# EAGLE design Lynx_Shield (EAGLE 9.6.2)
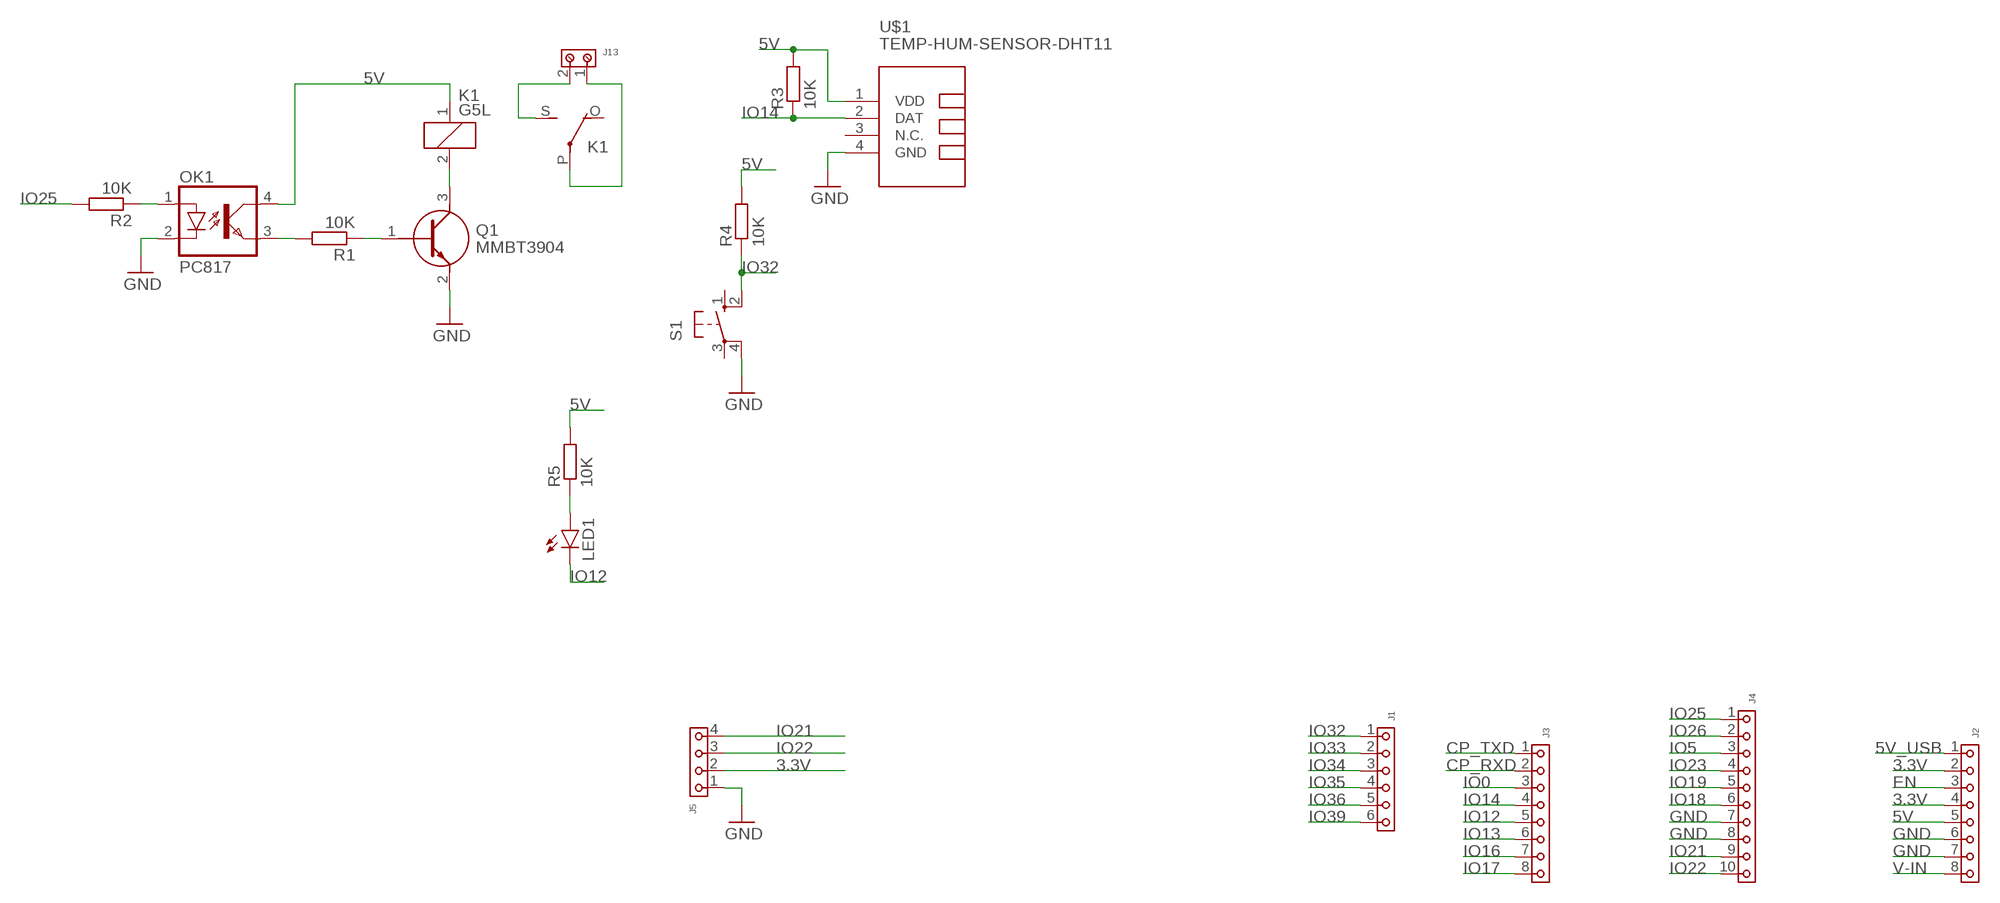
[diagram p0: schematic, sheet 1]

## Parts
J1  6130XX11821_61300611821  [61300611821]
J2  6130XX11821_61300811821  [61300811821]
J3  6130XX11821_61300811821  [61300811821]
J4  6130XX11821_61301011821  [61301011821]
J5  6130XX11821_61300411821  [61300411821]
J13  691134710002  [691134710002]
K1  G5L  [G5LE]
LED1  LED5MM  [LED5MM]
OK1  PC817  [DIL04]
Q1  MMBT3904  [SOT95P240X120-3N]
R1  10K  R-EU_R0603  [R0603]
R2  10K  R-EU_R0603  [R0603]
R3  10K  R-EU_R0603  [R0603]
R4  10K  R-EU_R0603  [R0603]
R5  10K  R-EU_R0603  [R0603]
S1  10-XX  [B3F-10XX]
U$1  TEMP-HUM-SENSOR-DHT11  [TEMP-HUM-SENSOR-DHT11]

## Nets
3.3V: J2.2 J2.4 J5.2
5V: J2.5 K1.1 OK1.4(COL) R3.2 R4.2 R5.2 U$1.1(VDD)
5V_USB: J2.1
CP_RXD: J3.2
CP_TXD: J3.1
EN: J2.3
GND: J2.6 J2.7 J4.7 J4.8 J5.1 OK1.2(C) Q1.2(E) S1.4(P1) U$1.4(GND)
IO0: J3.3
IO5: J4.3
IO12: J3.5 LED1.K(C)
IO13: J3.6
IO14: J3.4 R3.1 U$1.2(DAT)
IO16: J3.7
IO17: J3.8
IO18: J4.6
IO19: J4.5
IO21: J4.9 J5.4
IO22: J4.10 J5.3
IO23: J4.4
IO25: J4.1 R2.2
IO26: J4.2
IO32: J1.1 R4.1 S1.2(S1)
IO33: J1.2
IO34: J1.3
IO35: J1.4
IO36: J1.5
IO39: J1.6
N$1: OK1.3(EMIT) R1.2
N$2: J13.2 K1.S(2:S)
N$4: J13.1 K1.P(2:P)
N$5: OK1.1(A) R2.1
N$6: K1.2 Q1.3(C)
N$8: Q1.1(B) R1.1
N$10: LED1.A R5.1
V-IN: J2.8
Unconnected: K1.O(2:O) S1.1(S) S1.3(P) U$1.3(N.C.)

## Library data of the parts
J1 = Wurth_Connectors_WR-PHD:6130XX11821_61300611821: WR-PHD 2.54 mm Socket Header ARTICLE PROPERTIES: Pins:1;​ 2;​ 3;​ 4;​ 5;​ 6;​ 7;​ 8;​ 9;​ 10;​ 12;​ 13;​ 14;​ 15;​ 16;​ 18;​ 20;​ 22;​ 24;​ 25;​ 32;​ 36;​ 40 KIND PROPERTIES: Pitch：2.54 mm Quality Class:3 as per CECC 75 301-802 Rows：Single Gender：Socket Header;​ Female Type：Straight MATERIAL PROPERTIES: Insulator Material :PBT Insulator Flammability Rating:UL94 V-0 Contact Material:Copper Alloy Contact Plating:Gold Contact Type:Stamped GENERAL INFORMATION Operating Temperature:-40 up to +125 °C Compliance:Lead free / RoHS ELECTRICAL PROPERTIES: Rated Current:3 A IR 1:3 A Withstanding Voltage:500 V (AC) Contact Resistance:20 mΩ RISO:1000 MΩ CERTIFICATION UL Approval:E323964 PACKAGING PROPERTIES Packaging:Tray <https://katalog.we-online.com/media/images/v2/o33218v209%20Family_WR-PHD_613xxx11821.jpg> Details see: https://katalog.we-online.com/en/em/PHD_2_54_SOCKET_HEADER_6130XX11821 Updated by Yingchun,Shan 2019-10-21 2019 (C) Würth Elektronik; DATASHEET-URL: https://katalog.we-online.com/em/datasheet/61300611821.pdf; GENDER: Socket Header; IR: 3A; MATES: WR-PHD 2.54mm SMT Pin Header/THT Angled Pin Header/THT Pin Header; PACKAGING: Tray; PART-NUMBER: 61300611821; PINS: 6; ROWS: Single; TYPE: Straight
J2 J3 = Wurth_Connectors_WR-PHD:6130XX11821_61300811821: WR-PHD 2.54 mm Socket Header ARTICLE PROPERTIES: Pins:1;​ 2;​ 3;​ 4;​ 5;​ 6;​ 7;​ 8;​ 9;​ 10;​ 12;​ 13;​ 14;​ 15;​ 16;​ 18;​ 20;​ 22;​ 24;​ 25;​ 32;​ 36;​ 40 KIND PROPERTIES: Pitch：2.54 mm Quality Class:3 as per CECC 75 301-802 Rows：Single Gender：Socket Header;​ Female Type：Straight MATERIAL PROPERTIES: Insulator Material :PBT Insulator Flammability Rating:UL94 V-0 Contact Material:Copper Alloy Contact Plating:Gold Contact Type:Stamped GENERAL INFORMATION Operating Temperature:-40 up to +125 °C Compliance:Lead free / RoHS ELECTRICAL PROPERTIES: Rated Current:3 A IR 1:3 A Withstanding Voltage:500 V (AC) Contact Resistance:20 mΩ RISO:1000 MΩ CERTIFICATION UL Approval:E323964 PACKAGING PROPERTIES Packaging:Tray <https://katalog.we-online.com/media/images/v2/o33218v209%20Family_WR-PHD_613xxx11821.jpg> Details see: https://katalog.we-online.com/en/em/PHD_2_54_SOCKET_HEADER_6130XX11821 Updated by Yingchun,Shan 2019-10-21 2019 (C) Würth Elektronik; DATASHEET-URL: https://katalog.we-online.com/em/datasheet/61300811821.pdf; GENDER: Socket Header; IR: 3A; MATES: WR-PHD 2.54mm SMT Pin Header/THT Angled Pin Header/THT Pin Header; PACKAGING: Tray; PART-NUMBER: 61300811821; PINS: 8; ROWS: Single; TYPE: Straight
J4 = Wurth_Connectors_WR-PHD:6130XX11821_61301011821: WR-PHD 2.54 mm Socket Header ARTICLE PROPERTIES: Pins:1;​ 2;​ 3;​ 4;​ 5;​ 6;​ 7;​ 8;​ 9;​ 10;​ 12;​ 13;​ 14;​ 15;​ 16;​ 18;​ 20;​ 22;​ 24;​ 25;​ 32;​ 36;​ 40 KIND PROPERTIES: Pitch：2.54 mm Quality Class:3 as per CECC 75 301-802 Rows：Single Gender：Socket Header;​ Female Type：Straight MATERIAL PROPERTIES: Insulator Material :PBT Insulator Flammability Rating:UL94 V-0 Contact Material:Copper Alloy Contact Plating:Gold Contact Type:Stamped GENERAL INFORMATION Operating Temperature:-40 up to +125 °C Compliance:Lead free / RoHS ELECTRICAL PROPERTIES: Rated Current:3 A IR 1:3 A Withstanding Voltage:500 V (AC) Contact Resistance:20 mΩ RISO:1000 MΩ CERTIFICATION UL Approval:E323964 PACKAGING PROPERTIES Packaging:Tray <https://katalog.we-online.com/media/images/v2/o33218v209%20Family_WR-PHD_613xxx11821.jpg> Details see: https://katalog.we-online.com/en/em/PHD_2_54_SOCKET_HEADER_6130XX11821 Updated by Yingchun,Shan 2019-10-21 2019 (C) Würth Elektronik; DATASHEET-URL: https://katalog.we-online.com/em/datasheet/61301011821.pdf; GENDER: Socket Header; IR: 3A; MATES: WR-PHD 2.54mm SMT Pin Header/THT Angled Pin Header/THT Pin Header; PACKAGING: Tray; PART-NUMBER: 61301011821; PINS: 10; ROWS: Single; TYPE: Straight
J5 = Wurth_Connectors_WR-PHD:6130XX11821_61300411821: WR-PHD 2.54 mm Socket Header ARTICLE PROPERTIES: Pins:1;​ 2;​ 3;​ 4;​ 5;​ 6;​ 7;​ 8;​ 9;​ 10;​ 12;​ 13;​ 14;​ 15;​ 16;​ 18;​ 20;​ 22;​ 24;​ 25;​ 32;​ 36;​ 40 KIND PROPERTIES: Pitch：2.54 mm Quality Class:3 as per CECC 75 301-802 Rows：Single Gender：Socket Header;​ Female Type：Straight MATERIAL PROPERTIES: Insulator Material :PBT Insulator Flammability Rating:UL94 V-0 Contact Material:Copper Alloy Contact Plating:Gold Contact Type:Stamped GENERAL INFORMATION Operating Temperature:-40 up to +125 °C Compliance:Lead free / RoHS ELECTRICAL PROPERTIES: Rated Current:3 A IR 1:3 A Withstanding Voltage:500 V (AC) Contact Resistance:20 mΩ RISO:1000 MΩ CERTIFICATION UL Approval:E323964 PACKAGING PROPERTIES Packaging:Tray <https://katalog.we-online.com/media/images/v2/o33218v209%20Family_WR-PHD_613xxx11821.jpg> Details see: https://katalog.we-online.com/en/em/PHD_2_54_SOCKET_HEADER_6130XX11821 Updated by Yingchun,Shan 2019-10-21 2019 (C) Würth Elektronik; DATASHEET-URL: https://katalog.we-online.com/em/datasheet/61300411821.pdf; GENDER: Socket Header; IR: 3A; MATES: WR-PHD 2.54mm SMT Pin Header/THT Angled Pin Header/THT Pin Header; PACKAGING: Tray; PART-NUMBER: 61300411821; PINS: 4; ROWS: Single; TYPE: Straight
J13 = Wurth_Connectors_WR-TBL Wire Protector:691134710002: WR-TBL Serie 1347- 5.00 mm Horizontal Cable Entry w. Pressure Clamp KIND PROPERTIES Pitch 5 mm MATERIAL PROPERTIES Insulator Material PC Insulator Flammability Rating UL94 V-0 Insulator Color Grey Contact Material Copper Alloy Contact Plating Nickel over Tin Contact Type Stamped Terminal Screw Material Steel Terminal Screw Plating Zinc Wire Guard Material Copper Alloy GENERAL INFORMATION Operating Temperature -30 up to +120 °C Compliance Lead free / RoHS ELECTRICAL PROPERTIES IR UL 16 A IR VDE 24 A Working Voltage [UL] 300 V (AC) Working Voltage [VDE] 450 V (AC) Withstanding Voltage [UL] 1600 V (AC) Withstanding Voltage [cULus] 2000 V (AC) Withstanding Voltage [VDE] 2500 V (AC) Contact Resistance 20 mΩ Contact Resistance [UL] 20 mΩ Contact Resistance [VDE] 20 mΩ MECHANICAL PROPERTIES Wire Strip Length 7 (mm) Screw M3 Solid Wire Section (AWG) 30 to 14 (AWG) Solid Wire Section (Metric) 0.05 to 2.08 (mm²) Stranded Wire Section (AWG) 30 to 14 (AWG) Stranded Wire Section (Metric) 0.05 to 2.08 (mm²) CERTIFICATION UL Approval E150931 CAT N: CMM (1) VDE Approval 40021362 VDE Approval 40021375 TYPE: CMM PACKAGING PROPERTIES Packaging Box <https://katalog.we-online.com/media/images/v2/o32799v209%20Family_WR-TBL1_Series1347.jpg> Details see: https://katalog.we-online.com/en/em/TBL_5_00_1347_HORIZONTAL_ENTRY_W_PRESSURE_CLAMP_69113471000x Updated by Ella Wu 2019-11-08 2019(C) Wurth Elektronik; DATASHEET-URL: https://www.we-online.com/catalog/datasheet/691134710002.pdf; IR-UL: 16A; IR-VDE: 24A; MOUNT: THT; PART-NUMBER: 691134710002; PINS: 2; PITCH: 5mm; TYPE: Horizontal; WIRE: 30 to 14 (AWG) 0.05 to 2.08 (mm²); WORKING-VOLTAGE-UL: 300V(AC); WORKING-VOLTAGE-VDE: 450V(AC)
K1 = relay:G5L: RELAY 1 x switch, 10 A/120 V AC, 8 A/30 V ADC, Omron; OC_FARNELL: unknown; OC_NEWARK: unknown
LED1 = led:LED: LED OSRAM: - CHIPLED LG R971, LG N971, LY N971, LG Q971, LY Q971, LO R971, LY R971 LH N974, LH R974 LS Q976, LO Q976, LY Q976 LO Q996 - Hyper CHIPLED LW Q18S LB Q993, LB Q99A, LB R99A - SideLED LS A670, LO A670, LY A670, LG A670, LP A670 LB A673, LV A673, LT A673, LW A673 LH A674 LY A675 LS A676, LA A676, LO A676, LY A676, LW A676 LS A679, LY A679, LG A679 - Hyper Micro SIDELED® LS Y876, LA Y876, LO Y876, LY Y876 LT Y87S - SmartLED LW L88C, LW L88S LB L89C, LB L89S, LG L890 LS L89K, LO L89K, LY L89K LS L896, LA L896, LO L896, LY L896 - TOPLED LS T670, LO T670, LY T670, LG T670, LP T670 LSG T670, LSP T670, LSY T670, LOP T670, LYG T670 LG T671, LOG T671, LSG T671 LB T673, LV T673, LT T673, LW T673 LH T674 LS T676, LA T676, LO T676, LY T676, LB T676, LH T676, LSB T676, LW T676 LB T67C, LV T67C, LT T67C, LS T67K, LO T67K, LY T67K, LW E67C LS E67B, LA E67B, LO E67B, LY E67B, LB E67C, LV E67C, LT E67C LW T67C LS T679, LY T679, LG T679 LS T770, LO T770, LY T770, LG T770, LP T770 LB T773, LV T773, LT T773, LW T773 LH T774 LS E675, LA E675, LY E675, LS T675 LS T776, LA T776, LO T776, LY T776, LB T776 LHGB T686 LT T68C, LB T68C - Hyper Mini TOPLED® LB M676 - Mini TOPLED Santana® LG M470 LS M47K, LO M47K, LY M47K Source: http://www.osram.convergy.de LUXEON: - LUMILED® LXK2-PW12-R00, LXK2-PW12-S00, LXK2-PW14-U00, LXK2-PW14-V00 LXK2-PM12-R00, LXK2-PM12-S00, LXK2-PM14-U00 LXK2-PE12-Q00, LXK2-PE12-R00, LXK2-PE12-S00, LXK2-PE14-T00, LXK2-PE14-U00 LXK2-PB12-K00, LXK2-PB12-L00, LXK2-PB12-M00, LXK2-PB14-N00, LXK2-PB14-P00, LXK2-PB14-Q00 LXK2-PR12-L00, LXK2-PR12-M00, LXK2-PR14-Q00, LXK2-PR14-R00 LXK2-PD12-Q00, LXK2-PD12-R00, LXK2-PD12-S00 LXK2-PH12-R00, LXK2-PH12-S00 LXK2-PL12-P00, LXK2-PL12-Q00, LXK2-PL12-R00 Source: www.luxeon.com KINGBRIGHT: KA-3528ASYC Source: www.kingbright.com
OK1 = optocoupler:PC817: SHARP OPTO COUPLER; MPN: PC817X4J000F; OC_FARNELL: 9707727; OC_NEWARK: 97K7059
Q1 = MMBT3904:MMBT3904: Transistor GP BJT NPN 40V 0.2A SOT23 Fairchild MMBT3904 NPN Bipolar Transistor, 0.2 A, 40 V, 3-Pin SOT-23 Source: Datasheet <https://media.digikey.com/pdf/Data Sheets/ON Semiconductor PDFs/2N3904,MMBT3904,PZT3904.pdf>; ARROW_PART_NUMBER: MMBT3904; ARROW_PRICE-STOCK: https://www.arrow.com/en/products/mmbt3904/on-semiconductor; DESCRIPTION: Transistor GP BJT NPN 40V 0.2A SOT23 Fairchild MMBT3904 NPN Bipolar Transistor, 0.2 A, 40 V, 3-Pin SOT-23; HEIGHT: 1.2mm; MANUFACTURER_NAME: ON Semiconductor; MANUFACTURER_PART_NUMBER: MMBT3904; MOUSER_PART_NUMBER: 512-MMBT3904; MOUSER_PRICE-STOCK: https://www.mouser.co.uk/ProductDetail/ON-Semiconductor-Fairchild/MMBT3904?qs=UMEuL5FsraCg3xKjS4uBJQ%3D%3D
R1-R5 = rcl:R-EU_: RESISTOR, European symbol; SPICEPREFIX: R
S1 = switch-omron:10-XX: OMRON SWITCH; MPN: B3F-1000; OC_FARNELL: 176432; OC_NEWARK: 36M3542
U$1 = diy-modules:TEMP-HUM-SENSOR-DHT11: DHT11 - digital humidity & temperature sensor DHT11 datasheet available here: https://akizukidenshi.com/download/ds/aosong/DHT11.pdf Click here to find device on ebay.com <http://www.ebay.com/sch/dht11+digital+sensor>

## Board
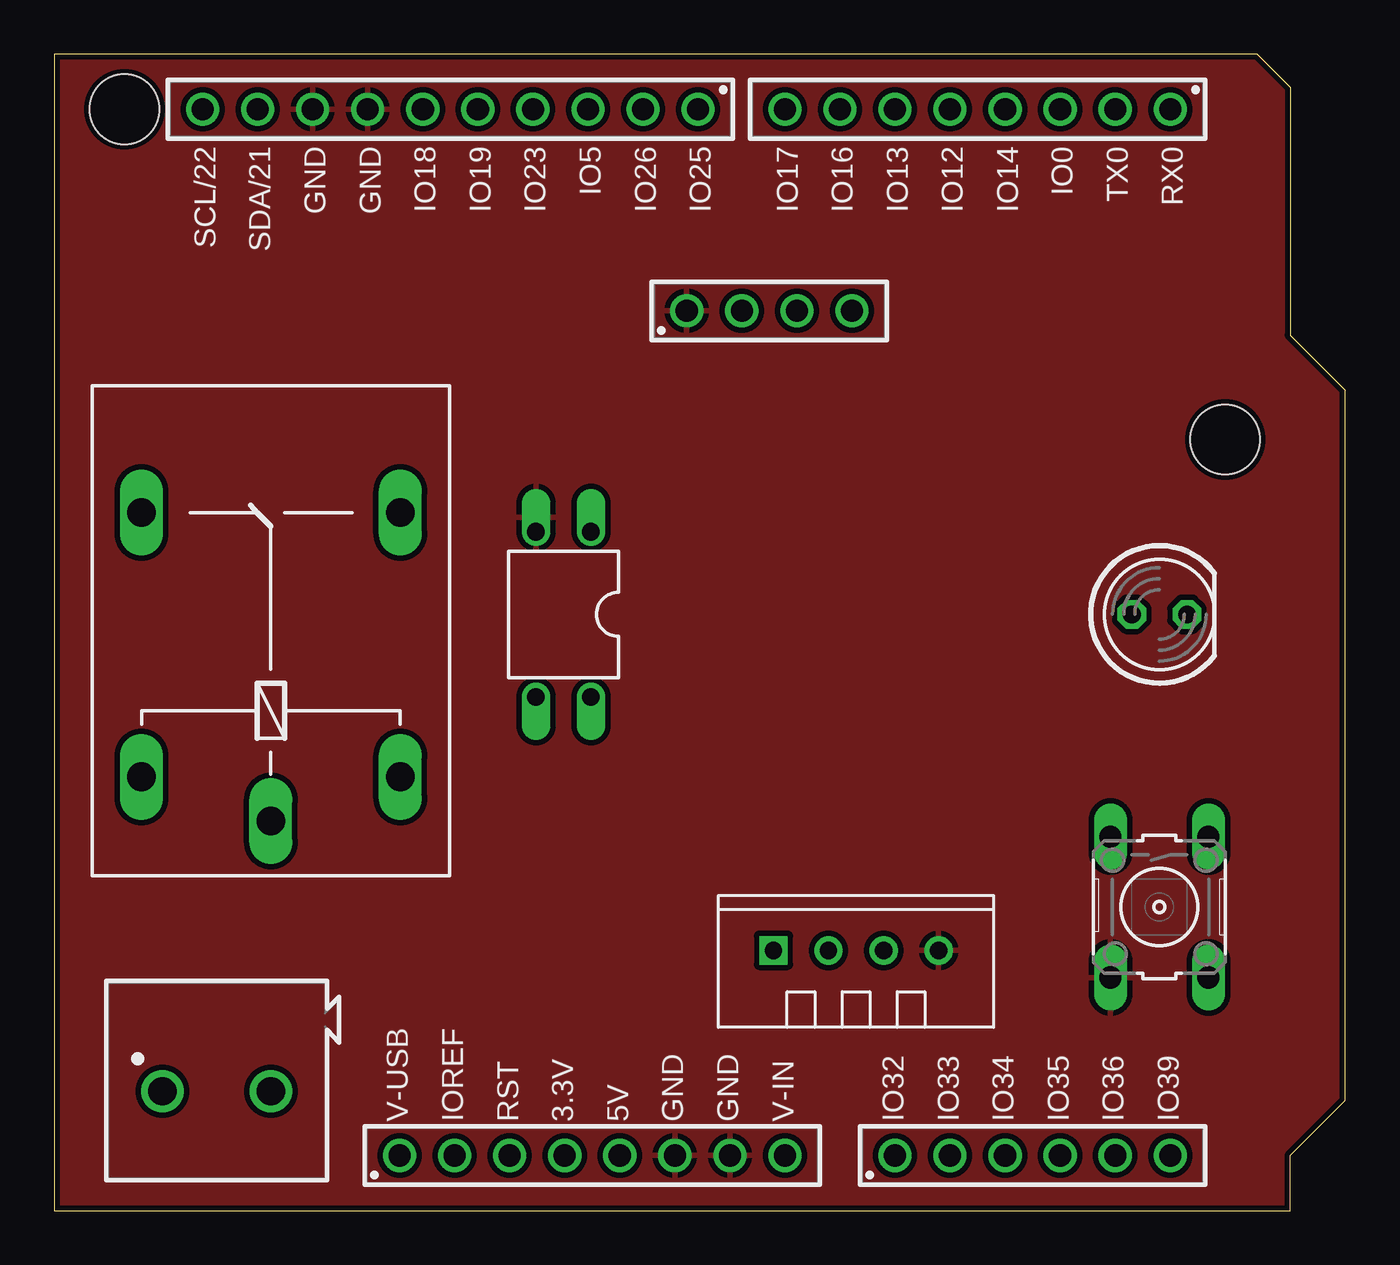
[diagram p1: board, top side]
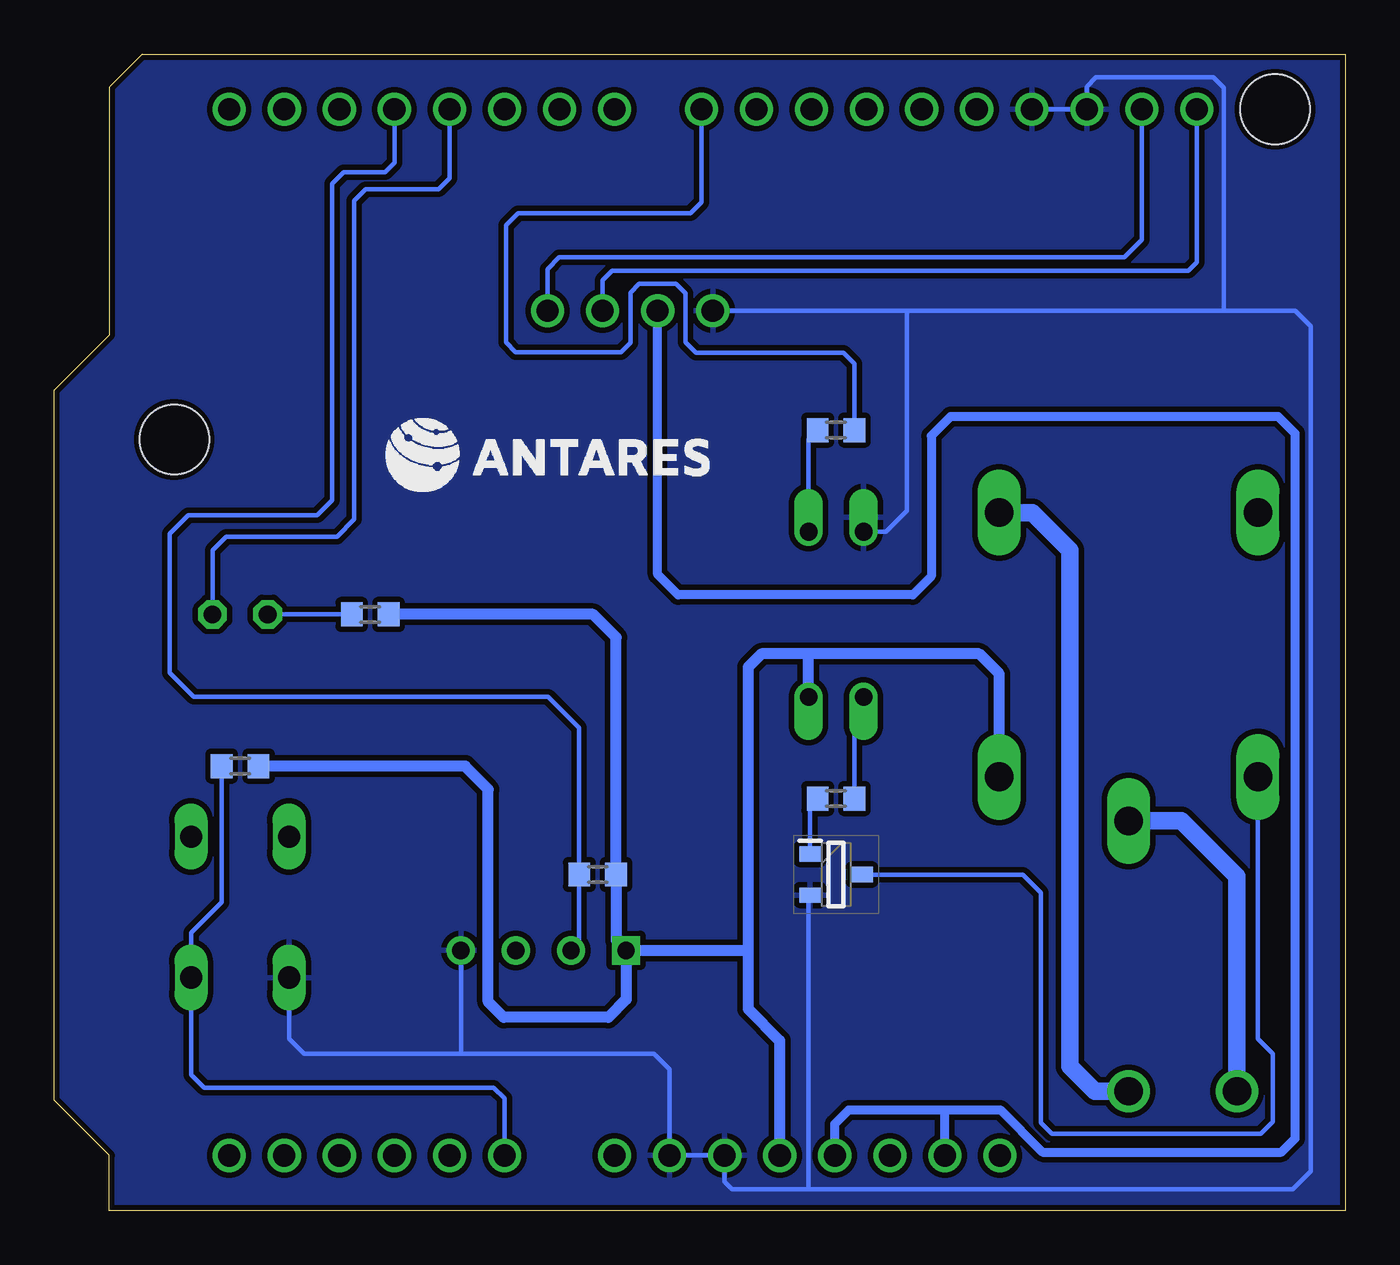
[diagram p2: board, bottom side, seen from below]

Size 59.58 x 53.34 mm. Coordinates in mm from the lower left corner, seen from the top.
Outline: 0,0 57.04,0 57.04,2.54 59.58,5.08 59.58,37.84 57.04,40.38 57.04,51.82 55.52,53.34 0,53.34 0,0
Copper layers (1*16): Top 0.035mm / dielectric 0.2mm / Bottom 0.035mm
Design rules "default *": minimum track width 5mil, minimum drill 0.25mm, track to track 5mil, track to pad 6mil, pad to pad 6mil, via to via 6mil, smd to smd 6mil, copper to edge 10mil, drill to drill 6mil, minimum pad ring 10mil, minimum via ring 8mil, stop-mask expansion 4mil, vias tented up to drill 25mil, thermal gap 10mil
Holes 3.2 mm at 54.04,35.56 3.24,50.8
vRestrict: 3 lines

### Footprints (pad centres in the part's own frame; a part is rotated, then mirrored left to right if it is on the bottom)
61300611821 = drill 1.02: 1 -6.35,0; 2 -3.81,0; 3 -1.27,0; 4 1.27,0; 5 3.81,0; 6 6.35,0
61300811821 = drill 1.02: 1 -8.89,0; 2 -6.35,0; 3 -3.81,0; 4 -1.27,0; 5 1.27,0; 6 3.81,0; 7 6.35,0; 8 8.89,0
61301011821 = drill 1.02: 1 -11.43,0; 2 -8.89,0; 3 -6.35,0; 4 -3.81,0; 5 -1.27,0; 6 1.27,0; 7 3.81,0; 8 6.35,0; 9 8.89,0; 10 11.43,0
61300411821 = drill 1.02: 1 -3.81,0; 2 -1.27,0; 3 1.27,0; 4 3.81,0
691134710002 = drill 1.3: 1 -2.5,0; 2 2.5,0
G5LE = drill 1.321 long: 1 -7.493,-5.969; 2 -7.493,5.969; O 4.699,5.969; P -9.525,0; S 4.699,-5.969
LED5MM = drill 0.813 octagon: A -1.27,0; K 1.27,0
DIL04 = drill 0.813 offset: 1 -1.27,-3.81; 2 1.27,-3.81; 3 1.27,3.81; 4 -1.27,3.81
SOT95P240X120-3N = smd 1 x 0.7: 1 -1.2,0.95; 2 -1.2,-0.95; 3 1.2,0
R0603 = smd 1 x 1.1: 1 -0.85,0; 2 0.85,0
B3F-10XX = drill 1.016 long: 1 -3.251,2.261; 2 3.251,2.261; 3 -3.251,-2.261; 4 3.251,-2.261
TEMP-HUM-SENSOR-DHT11 = drill 0.8 square: 1 -3.81,0 | drill 0.8: 2 -1.27,0; 3 1.27,0; 4 3.81,0

### Placement (x,y rotation side)
J1  45.15,2.54 0 top
J2  24.83,2.54 0 top
J3  42.61,50.8 180 top
J4  18.28,50.8 180 top
J5  33,41.5 0 top
J13  7.5,5.5 0 top
K1  10,27.5 90 top
LED1  51,27.5 0 top
OK1  23.5,27.5 180 top
Q1  23.5,15.5 0 bottom
R1  23.5,19 0 bottom
R2  23.5,36 0 bottom
R3  34.5,15.5 0 bottom
R4  51,20.5 0 bottom
R5  45,27.5 0 bottom
S1  51,14 270 top
U$1  37,12 0 top

### Tracks (layer width: path | path; a pad name or v marks a point on that pad's centre or on a via)
3.3V
  Bottom 0.406: J2.4 23.56,4 22.91,4.65 18.52,4.65 | 18.52,4.65 15.93,4.65 13.97,2.69 2.95,2.69 2.31,3.33 2.31,35.84 3.1,36.63 18.21,36.63 19.1,35.74 19.1,29.26 19.96,28.4 30.79,28.4 31.73,29.34 J5.2 | J2.2 18.48,4.61 18.52,4.65
5V
  Bottom 0.508: K1.1 15.97,24.76 16.89,25.68 24.77,25.68 | 24.77,25.68 26.95,25.68 27.56,25.07 27.56,11.96 | OK1.4 24.77,25.67 24.77,25.68 | 27.56,11.96 27.56,9.3 26.1,7.84 J2.5 | U$1.1 27.6,12 27.56,11.96 | U$1.1 33.65,12.46 R3.2 33.65,26.44 34.71,27.5 R5.2 | U$1.1 33.19,9.74 34.01,8.91 38.84,8.91 39.55,9.63 39.55,19.43 40.62,20.5 R4.2
GND
  Bottom 0.203: 40.82,7.24 31.9,7.24 31.18,6.52 J2.7 J2.6 28.64,1.33 28.3,0.99 24.77,0.99 | 40.82,7.24 48.06,7.24 48.74,7.92 S1.4 | U$1.4 40.81,7.25 40.82,7.24 | OK1.2 21.19,31.31 20.22,32.28 20.22,41.5 | 20.22,41.5 J5.1 | Q1.2 24.77,14.48 24.77,0.99 | J4.7 J4.8 11.93,51.85 11.51,52.27 6.1,52.27 5.61,51.79 5.61,41.5 | 5.61,41.5 20.22,41.5 | 24.77,0.99 2.41,0.99 1.6,1.8 1.6,40.79 2.31,41.5 5.61,41.5
  pour Bottom (isolate 0.254): 0,0 60,0 60,24 60,54 50,54 0,54
  pour Top (isolate 0.254): 0,0 60,0 60,27 60,54 24,54 0,54
IO12
  Bottom 0.203: LED1.K 52.27,30.46 51.64,31.09 46.53,31.09 45.74,31.88 45.74,46.58 45.21,47.12 41.83,47.12 41.34,47.61 J3.5
IO14
  Bottom 0.203: U$1.2 35.35,12.38 R3.1 35.35,22.27 36.78,23.7 53.14,23.7 54.25,24.82 54.25,31.22 53.39,32.08 47.45,32.08 46.76,32.77 46.76,47.37 46.23,47.9 44.3,47.9 43.88,48.32 J3.4
IO21
  Bottom 0.203: J5.4 36.81,43.43 36.27,43.97 10.2,43.97 9.39,44.78 J4.9
IO22
  Bottom 0.203: J5.3 34.27,42.92 33.83,43.36 7.24,43.36 6.85,43.75 J4.10
IO25
  Bottom 0.203: R2.2 22.65,39.06 23.16,39.57 29.97,39.57 30.45,40.06 30.45,42.32 30.89,42.75 32.59,42.75 32.99,42.34 32.99,40.03 33.43,39.6 38.28,39.6 38.73,40.06 38.73,45.44 38.18,46 30.23,46 29.71,46.52 J4.1
IO32
  Bottom 0.203: R4.1 51.85,14.21 53.26,12.8 S1.2 53.26,6.27 52.65,5.66 39.29,5.66 38.8,5.17 J1.1
N$1
  Bottom 0.203: OK1.3 22.65,23.27 R1.2
N$2
  Bottom 0.813: K1.S 14.44,32.2 12.7,30.45 12.7,6.65 11.55,5.5 J13.2
N$4
  Bottom 0.813: K1.P 7.56,17.98 5,15.41 J13.1
N$5
  Bottom 0.203: R2.1 24.77,35.58 OK1.1
N$6
  Bottom 0.203: K1.2 4.03,7.92 3.35,7.24 3.35,4.09 3.91,3.53 13.54,3.53 14.05,4.04 14.05,14.66 14.89,15.5 Q1.3
N$8
  Bottom 0.203: R1.1 24.7,18.65 Q1.1
N$10
  Bottom 0.203: R5.1 LED1.A

### Text on the board
tPlace: SCL/22 | SDA/21 | GND | GND | IO18 | IO19 | IO23 | IO5 | IO26 | IO25 | IO17 | IO16 | IO13 | IO12 | IO14 | IO0 | TX0 | RX0 | V-USB | IOREF | RST | 3.3V | 5V | GND | GND | V-IN | IO32 | IO33 | IO34 | IO35 | IO36 | IO39
tStop: RELAY IO25 | LED IO12 | BTN IO32 | AC LOAD | DHT IO14 | LYNX-SHIELD AM-01 | AM-01